# Altium schematic sheet 相敏检波器.SchDoc
size A4
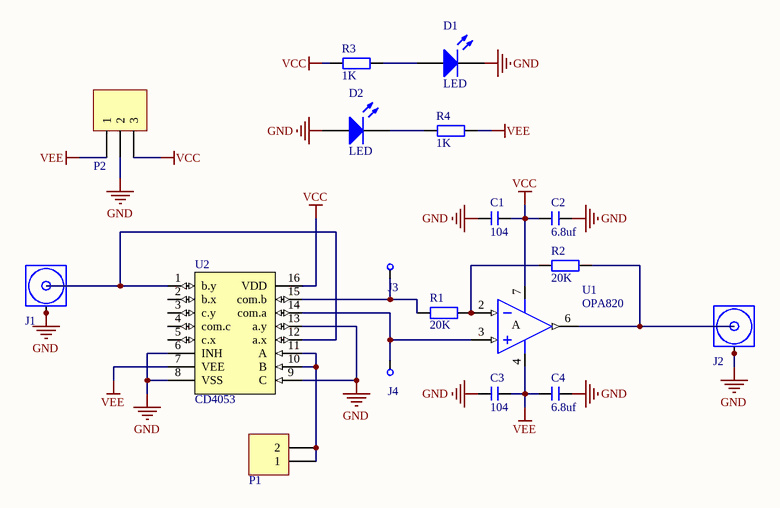
[diagram p0: 相敏检波器.SchDoc]

## Parts
C1  104  [C 0805]
C2  6.8uf  [C 0805]
C3  104  [C 0805]
C4  6.8uf  [C 0805]
D1  LED  [LED_0805]
D2  LED  [LED_0805]
J1  COAX  [MCX5.08-5-H]  (value not drawn)
J2  COAX  [MCX5.08-5-H]  (value not drawn)
J3  CHECK  [CHECK-A]  (value not drawn)
J4  CHECK  [CHECK-A]  (value not drawn)
P1  Header 2  [HDR2X1_B2]  (value not drawn)
P2  Header 3  [HDR3X1_B2]  (value not drawn)
R1  20K  [R 0805]
R2  20K  [R 0805]
R3  1K  [R 0805]
R4  1K  [R 0805]
U1  OPA820  [SOIC8_N]
U2  CD4053  [NSO16_M]

## Nets
GND: C1.1 C2.2 C3.1 C4.2 D1.2(K) D2.1(A) J1.2(GND) J1.3(GND) J1.4(GND) J1.5(GND) J2.2(GND) J2.3(GND) J2.4(GND) J2.5(GND) P2.2 U2.6(INH) U2.8(VSS) U2.9(C) U2.13(a.y)
VCC: C1.2 C2.1 P2.3 R3.1 U1.7(V+) U2.16(VDD)
VEE: C3.2 C4.1 P2.1 R4.2 U1.4(V-) U2.7(VEE)
NetD1_1: D1.1(A) R3.2
NetD2_2: D2.2(K) R4.1
NetJ1_1: J1.1(Signal) U2.1(b.y) U2.12(a.x)
NetJ2_1: J2.1(Signal) R2.2 U1.6(OUT)
NetJ3_1: J3.1 R1.1 U2.15(com.b)
NetJ4_1: J4.1 U1.3(+IN) U2.14(com.a)
NetP1_1: P1.1 P1.2 U2.10(B) U2.11(A)
NetR1_2: R1.2 R2.1 U1.2(-IN)

Not connected (* = marked no-connect by the designer): U2 2(b.x) 3(c.y) 4(com.c) 5(c.x)

## Notes on the sheet
- (in symbol OPA820) A

## Library data of the parts
C1-C4 = C: 无极性贴片电容; 版权归属: 源创客; BOM名称: 无极性贴片电容; 学习资源: www.ooocke.com
D1 D2 = LED: 发光二极管; Published: 8-Jun-2000; LatestRevisionDate: 08-Jul-2005; LatestRevisionNote: Mech Layer 1 removed.; PackageReference: LED; Publisher: Altium Limited
J3 J4 = CHECK: 测试点
P1 = Header 2: 接插件; LatestRevisionDate: 17-Jul-2002; LatestRevisionNote: Re-released for DXP Platform.; Publisher: Altium Limited
P2 = Header 3: 接插件; LatestRevisionDate: 17-Jul-2002; LatestRevisionNote: Re-released for DXP Platform.; Publisher: Altium Limited
R1-R4 = R: 贴片电阻; 版权归属: 源创客; BOM名称: 贴片电阻; 学习资源: www.ooocke.com
U1 = OPA820: 单位增益稳定低噪声电压反馈运算放大器
U2 = CD4053: CMOS Single 8-Channel Analog Multiplexer/Demultiplexer  With Logic-Level Conversion